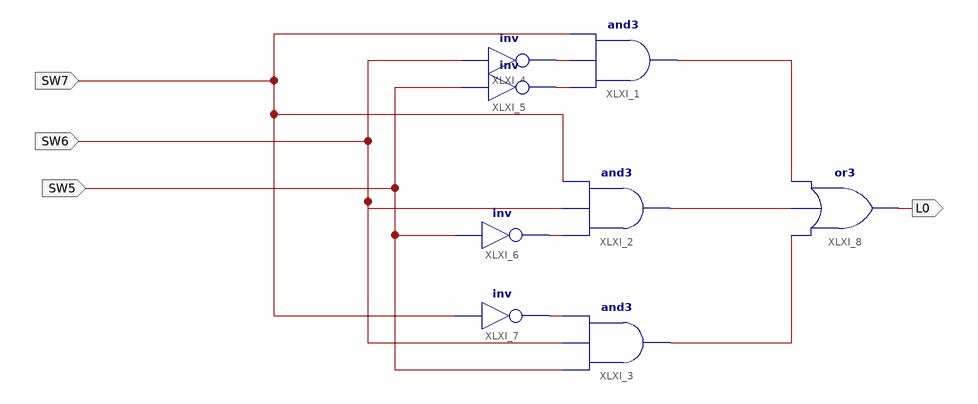
[diagram p0: schematic sheet 1]
// Xilinx ISE schematic Alarm.sch (spartan6) as structural Verilog: 8 symbols, 4 ports
module Alarm (
  input  SW7,
  input  SW6,
  input  SW5,
  output L0
);

  wire XLXN_6, XLXN_7, XLXN_8, XLXN_9, XLXN_14, XLXN_15, XLXN_17;

  and XLXI_1 (XLXN_14, XLXN_7, XLXN_6, SW7);
  and XLXI_2 (XLXN_15, XLXN_8, SW6, SW7);
  and XLXI_3 (XLXN_17, SW5, SW6, XLXN_9);
  not XLXI_4 (XLXN_6, SW6);
  not XLXI_5 (XLXN_7, SW5);
  not XLXI_6 (XLXN_8, SW5);
  not XLXI_7 (XLXN_9, SW7);
  or XLXI_8 (L0, XLXN_17, XLXN_15, XLXN_14);
endmodule
